# EAGLE design MacroPad (EAGLE 9.4.0)
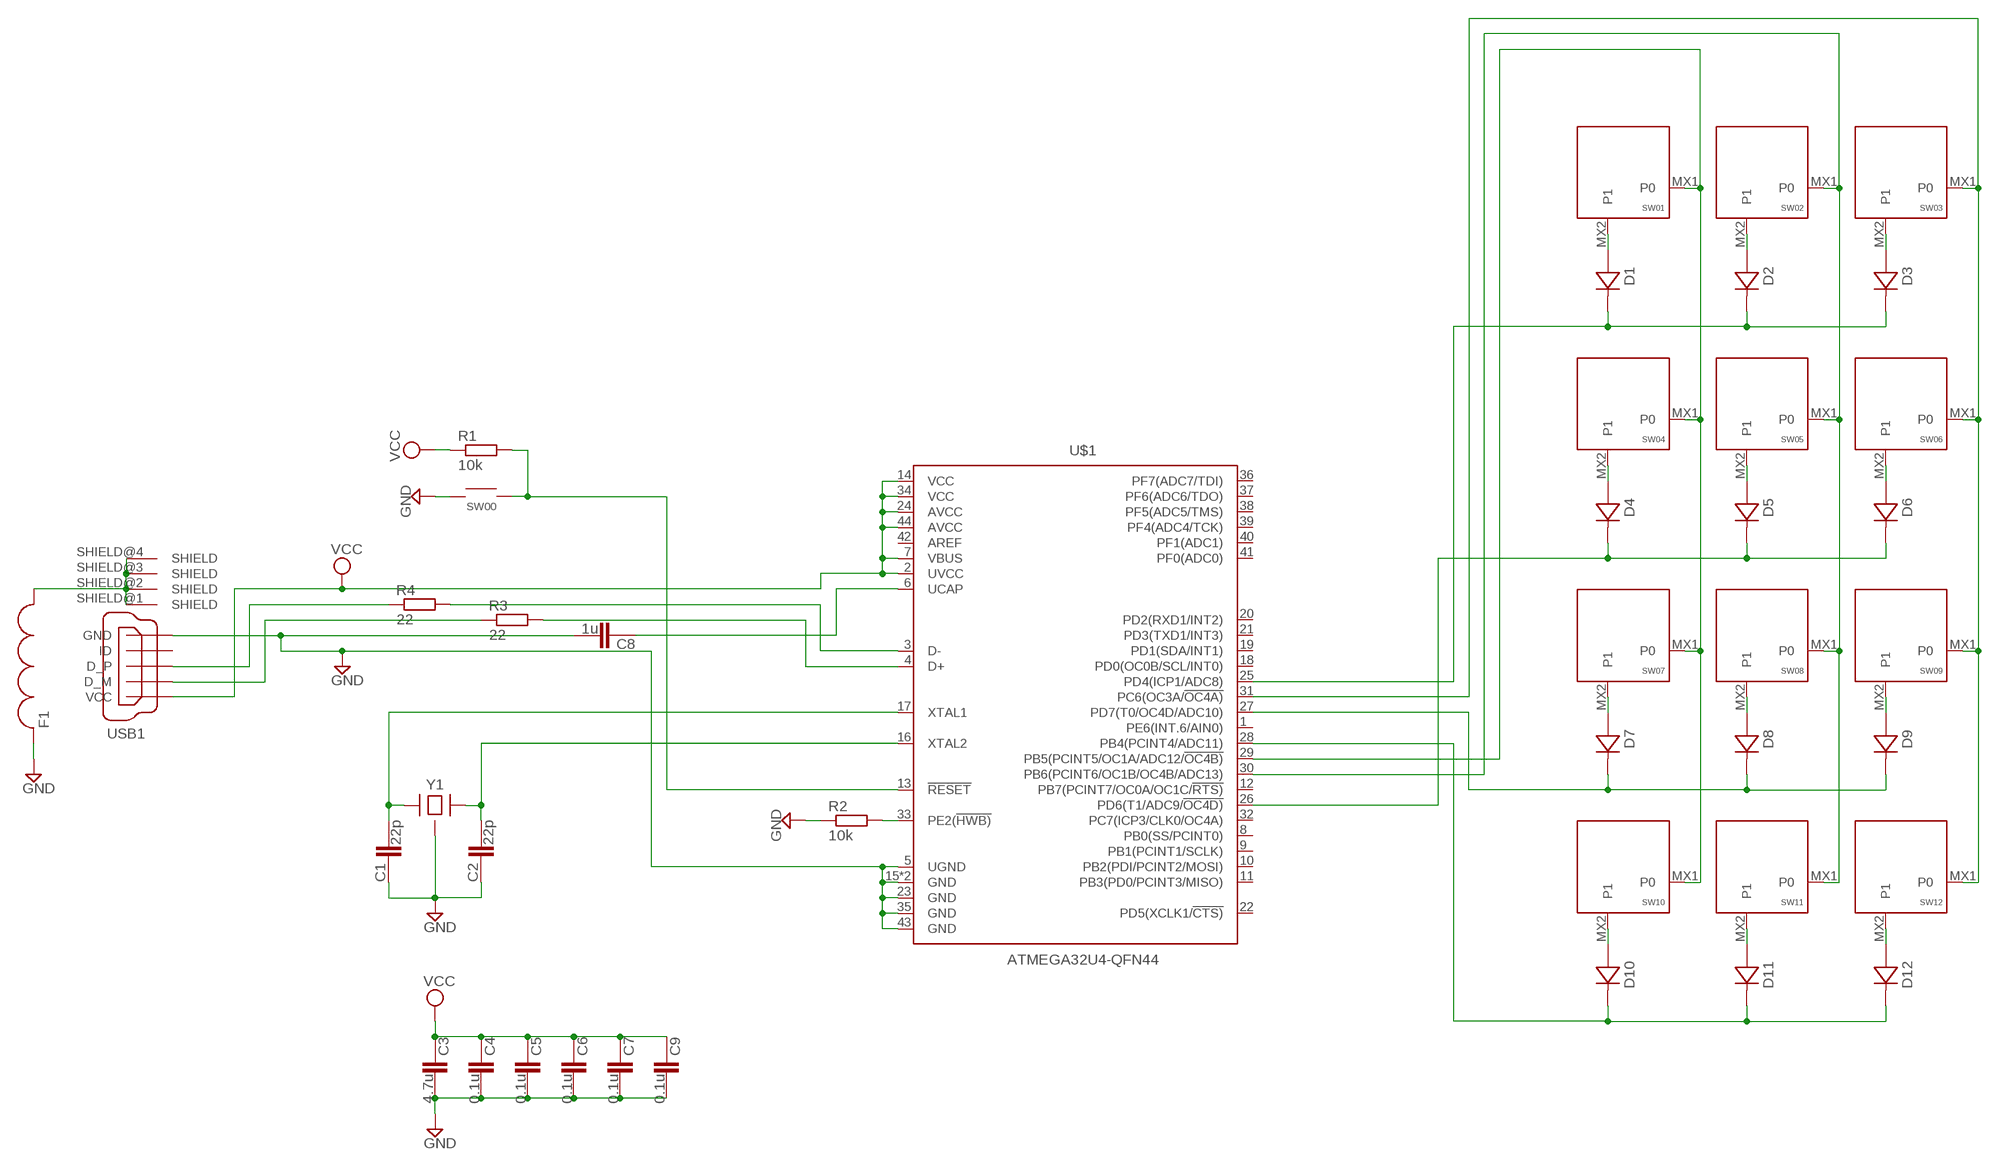
[diagram p0: schematic, sheet 1]

## Parts
C1  22p  CAPACITOR-0603  [C0603]
C2  22p  CAPACITOR-0603  [C0603]
C3  4.7u  CAPACITOR-0603  [C0603]
C4  0.1u  CAPACITOR-0603  [C0603]
C5  0.1u  CAPACITOR-0603  [C0603]
C6  0.1u  CAPACITOR-0603  [C0603]
C7  0.1u  CAPACITOR-0603  [C0603]
C8  1u  CAPACITOR-0603  [C0603]
C9  0.1u  CAPACITOR-0603  [C0603]
D1  DIODE-DFN0603-2  [DFN0603-2]
D2  DIODE-DFN0603-2  [DFN0603-2]
D3  DIODE-DFN0603-2  [DFN0603-2]
D4  DIODE-DFN0603-2  [DFN0603-2]
D5  DIODE-DFN0603-2  [DFN0603-2]
D6  DIODE-DFN0603-2  [DFN0603-2]
D7  DIODE-DFN0603-2  [DFN0603-2]
D8  DIODE-DFN0603-2  [DFN0603-2]
D9  DIODE-DFN0603-2  [DFN0603-2]
D10  DIODE-DFN0603-2  [DFN0603-2]
D11  DIODE-DFN0603-2  [DFN0603-2]
D12  DIODE-DFN0603-2  [DFN0603-2]
F1  FERRITE-0805  [F0805]
R1  10k  RESISTOR-0603  [R0603]
R2  10k  RESISTOR-0603  [R0603]
R3  22  RESISTOR-0603  [R0603]
R4  22  RESISTOR-0603  [R0603]
SW00  SWITCH-SMD-EVQP-P2602W  [SWITCH-SMD-EVQP-P2602W]
SW01  KEYSWITCH-PLAIN-MX-1U  [MX-1U]
SW02  KEYSWITCH-PLAIN-MX-1U  [MX-1U]
SW03  KEYSWITCH-PLAIN-MX-1U  [MX-1U]
SW04  KEYSWITCH-PLAIN-MX-1U  [MX-1U]
SW05  KEYSWITCH-PLAIN-MX-1U  [MX-1U]
SW06  KEYSWITCH-PLAIN-MX-1U  [MX-1U]
SW07  KEYSWITCH-PLAIN-MX-1U  [MX-1U]
SW08  KEYSWITCH-PLAIN-MX-1U  [MX-1U]
SW09  KEYSWITCH-PLAIN-MX-1U  [MX-1U]
SW10  KEYSWITCH-PLAIN-MX-1U  [MX-1U]
SW11  KEYSWITCH-PLAIN-MX-1U  [MX-1U]
SW12  KEYSWITCH-PLAIN-MX-1U  [MX-1U]
U$1  ATMEGA32U4-QFN44  [QFN-44]
USB1  USB_CONN-MINI-FEMALE  [UX60-MB-5S8]
Y1  CRYSTAL-4PIN-3.2X2.5  [CRYSTAL-3.2X2.5]

## Nets
GND: C1.1 C2.1 C3.2 C4.2 C5.2 C6.2 C7.2 C8.2 C9.2 F1.1 R2.1 SW00.1A SW00.1B U$1.5(UGND) U$1.15(GND) U$1.23(GND) U$1.35(GND) U$1.43(GND) U$1.TAB(GND) USB1.GND Y1.2(GND) Y1.4(GND)
N$1: C2.2 U$1.16(XTAL2) Y1.3
N$2: C1.2 U$1.17(XTAL1) Y1.1
N$3: R1.2 SW00.2A SW00.2B U$1.13(!RESET)
N$4: R2.2 U$1.33(PE2(!HWB))
N$5: R4.1 USB1.D+(D_P)
N$6: R4.2 U$1.3(D-)
N$7: R3.1 USB1.D-(D_M)
N$8: R3.2 U$1.4(D+)
N$9: D1.A SW01.MX2(P1)
N$10: SW01.MX1(P0) SW04.MX1(P0) SW07.MX1(P0) SW10.MX1(P0) U$1.29(PB5(PCINT5/OC1A/ADC12/!OC4B))
N$11: F1.2 USB1.SHIELD@1(SHIELD) USB1.SHIELD@2(SHIELD) USB1.SHIELD@3(SHIELD) USB1.SHIELD@4(SHIELD)
N$12: D2.A SW02.MX2(P1)
N$14: D1.C D2.C D3.C U$1.25(PD4(ICP1/ADC8))
N$15: D3.A SW03.MX2(P1)
N$16: SW03.MX1(P0) SW06.MX1(P0) SW09.MX1(P0) SW12.MX1(P0) U$1.31(PC6(OC3A/!OC4A))
N$18: D4.A SW04.MX2(P1)
N$21: D5.A SW05.MX2(P1)
N$24: D6.A SW06.MX2(P1)
N$26: D4.C D5.C D6.C U$1.26(PD6(T1/ADC9/!OC4D))
N$27: D7.A SW07.MX2(P1)
N$30: D8.A SW08.MX2(P1)
N$32: D7.C D8.C D9.C U$1.27(PD7(T0/OC4D/ADC10))
N$33: D9.A SW09.MX2(P1)
N$36: D10.A SW10.MX2(P1)
N$38: D10.C D11.C D12.C U$1.28(PB4(PCINT4/ADC11))
N$39: D11.A SW11.MX2(P1)
N$40: SW02.MX1(P0) SW05.MX1(P0) SW08.MX1(P0) SW11.MX1(P0) U$1.30(PB6(PCINT6/OC1B/OC4B/ADC13))
N$42: D12.A SW12.MX2(P1)
UCAP: C8.1 U$1.6(UCAP)
VCC: C3.1 C4.1 C5.1 C6.1 C7.1 C9.1 R1.1 U$1.2(UVCC) U$1.7(VBUS) U$1.14(VCC) U$1.24(AVCC) U$1.34(VCC) U$1.44(AVCC) USB1.VCC
Unconnected: U$1.1(PE6(INT.6/AIN0)) U$1.8(PB0(SS/PCINT0)) U$1.9(PB1(PCINT1/SCLK)) U$1.10(PB2(PDI/PCINT2/MOSI)) U$1.11(PB3(PD0/PCINT3/MISO)) U$1.12(PB7(PCINT7/OC0A/OC1C/!RTS)) U$1.18(PD0(OC0B/SCL/INT0)) U$1.19(PD1(SDA/INT1)) U$1.20(PD2(RXD1/INT2)) U$1.21(PD3(TXD1/INT3)) U$1.22(PD5(XCLK1/!CTS)) U$1.32(PC7(ICP3/CLK0/OC4A)) U$1.36(PF7(ADC7/TDI)) U$1.37(PF6(ADC6/TDO)) U$1.38(PF5(ADC5/TMS)) U$1.39(PF4(ADC4/TCK)) U$1.40(PF1(ADC1)) U$1.41(PF0(ADC0)) U$1.42(AREF) USB1.ID

## Library data of the parts
C1-C9 = Components:CAPACITOR
D1-D12 = Components:DIODE: Standard 1N4148 diode
F1 = USB:FERRITE
R1-R4 = Components:RESISTOR
SW00 = Hardware:SWITCH-SMD
SW01-SW09 SW10-SW12 = Keyboard:KEYSWITCH-PLAIN
U$1 = Controller:ATMEGA32U4
USB1 = Controller:USB_CONN
Y1 = Components:CRYSTAL-4PIN

## Board
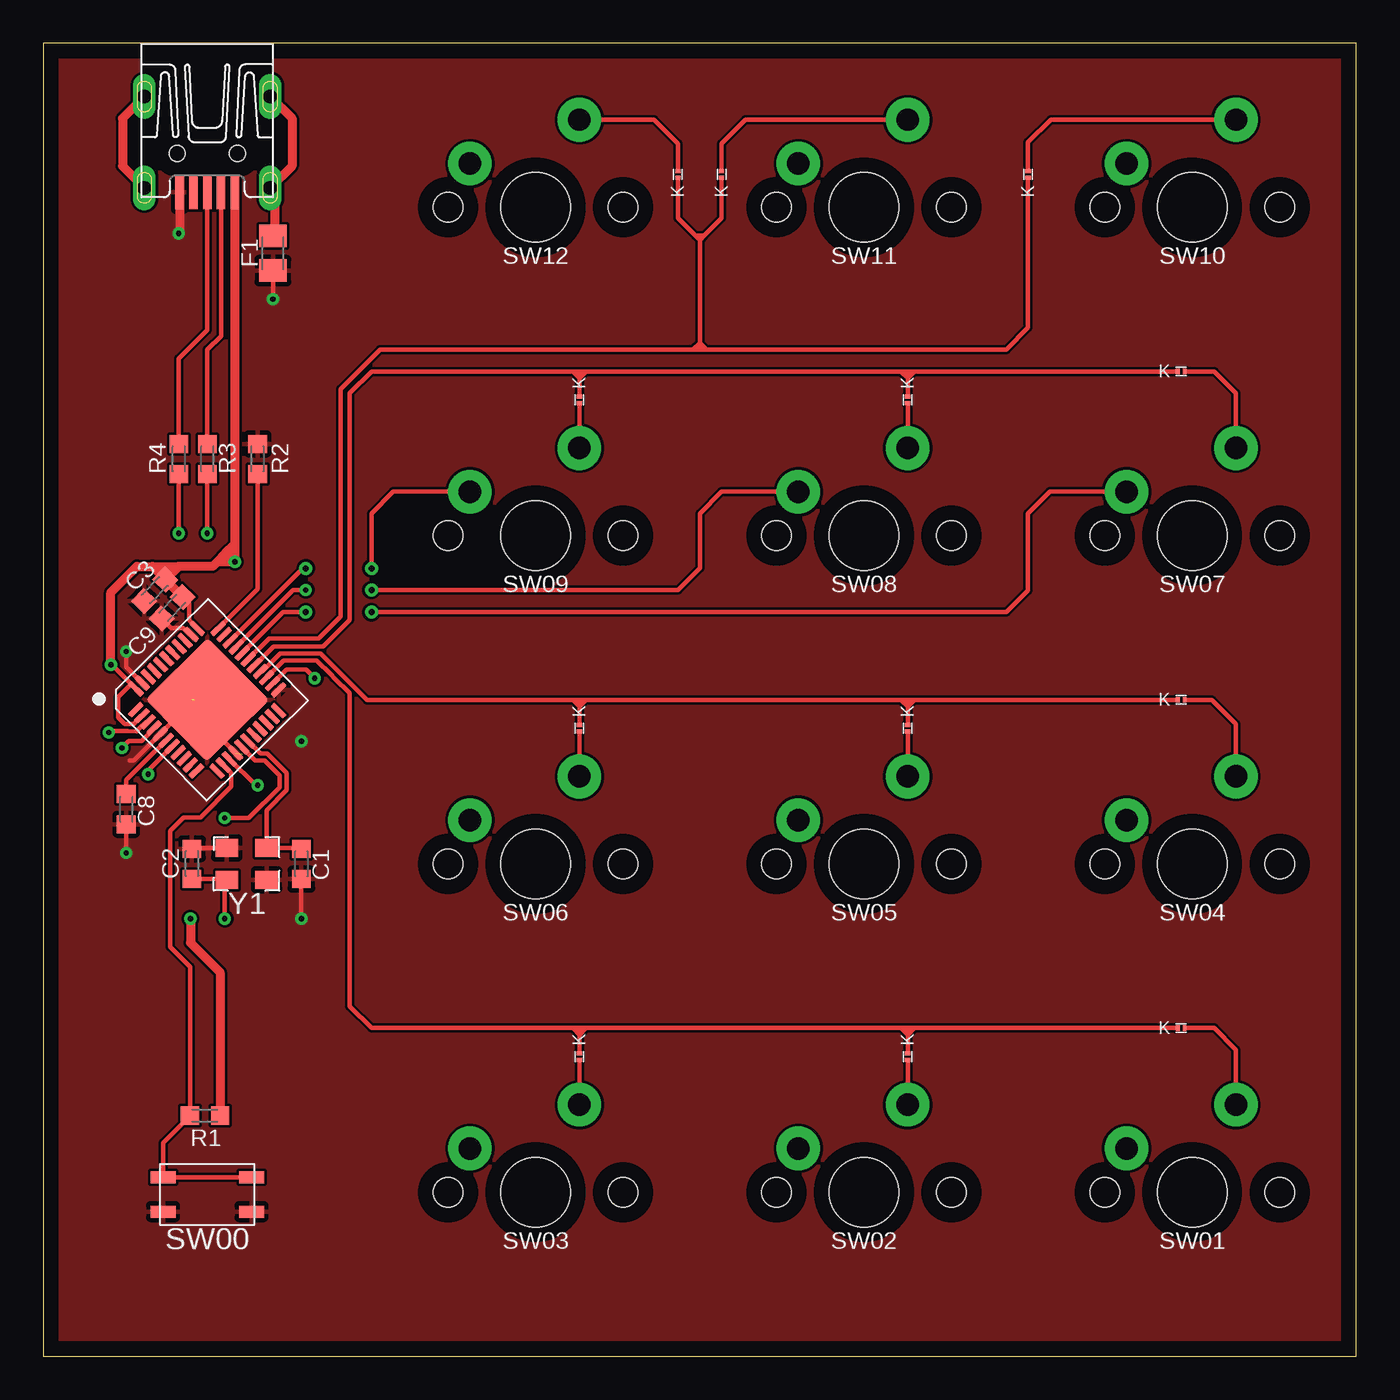
[diagram p1: board, top side]
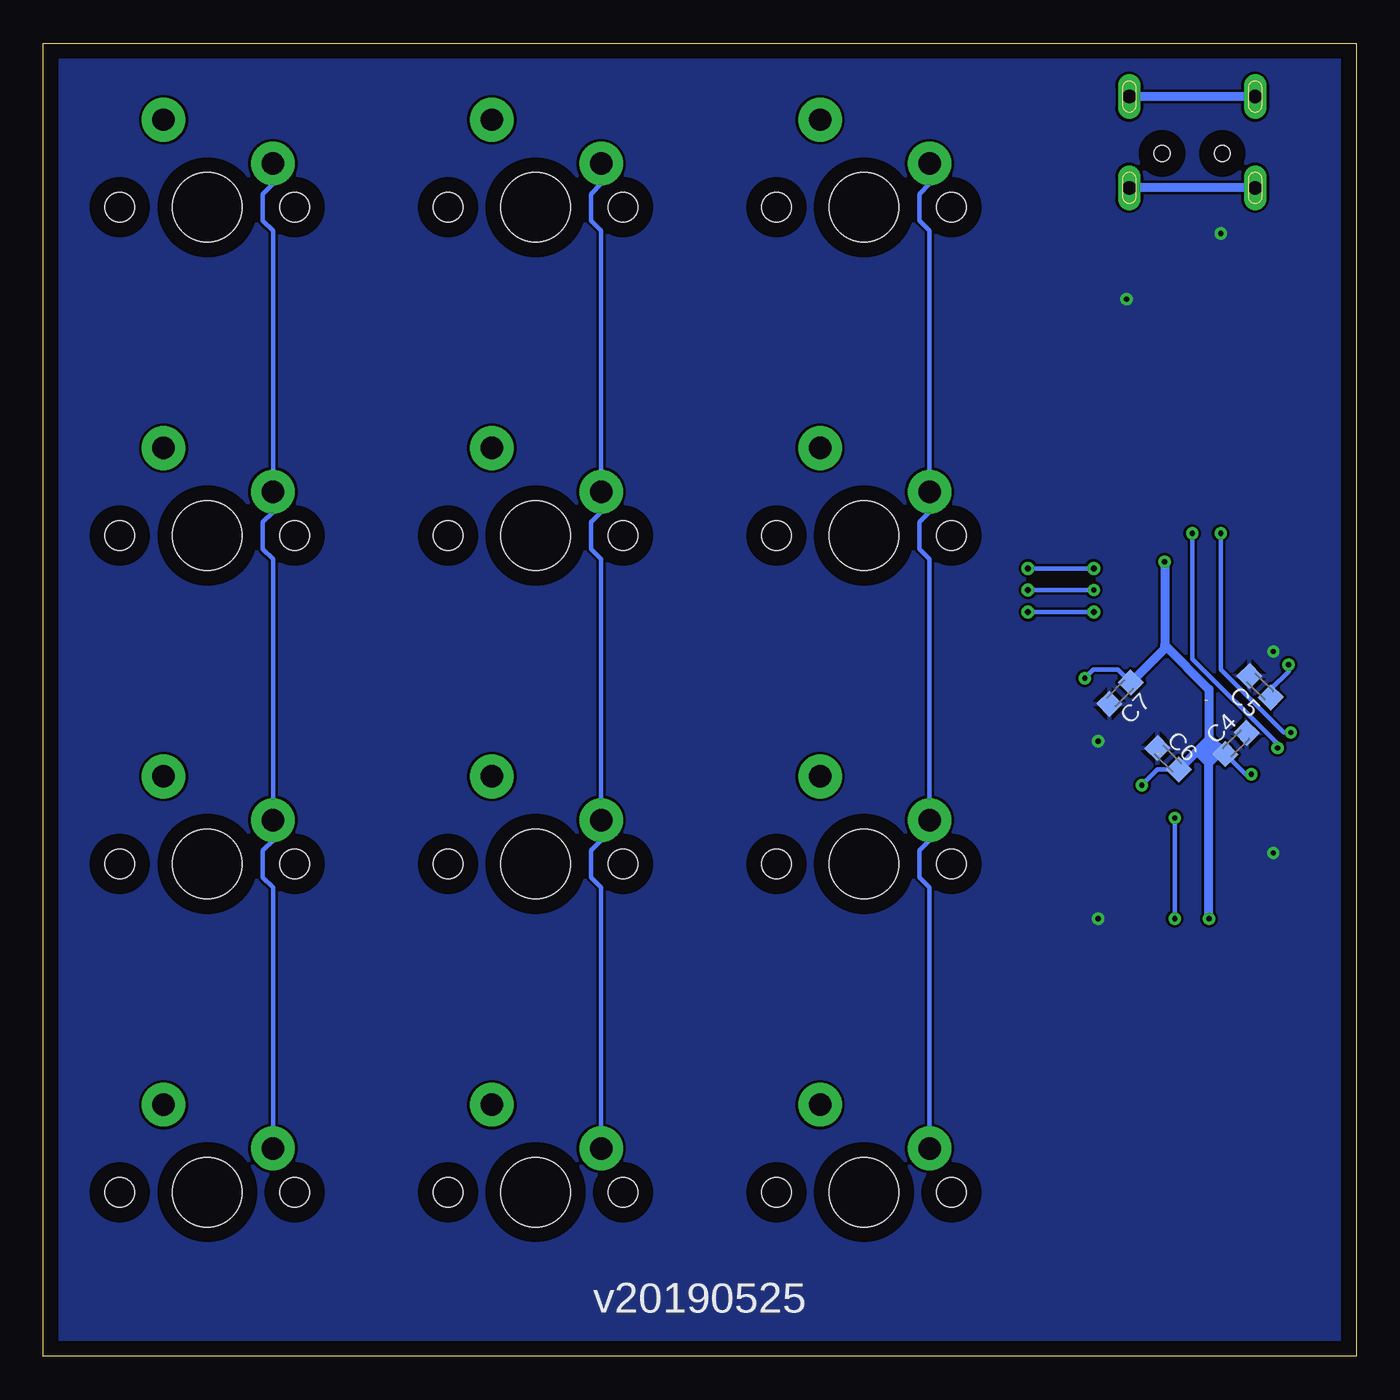
[diagram p2: board, bottom side, seen from below]

Size 76.2 x 76.2 mm. Coordinates in mm from the lower left corner, seen from the top.
Outline: 0,0 76.2,0 76.2,76.2 0,76.19 0,0
Copper layers (1*16): Top 0.035mm / dielectric 1.5mm / Bottom 0.035mm
Design rules "default *": minimum track width 6mil, minimum drill 0.35mm, track to track 6mil, track to pad 6mil, pad to pad 6mil, via to via 6mil, smd to smd 6mil, copper to edge 35mil, drill to drill 6mil, minimum pad ring 10mil, minimum via ring 8mil, stop-mask expansion 4mil, vias tented up to drill 0mil, thermal gap 10mil

### Footprints (pad centres in the part's own frame; a part is rotated, then mirrored left to right if it is on the bottom)
C0603 = smd 1.05 x 1.08: 1 -0.875,0; 2 0.875,0
DFN0603-2 = smd 0.23 x 0.3: A 0.19,0; C -0.19,0
F0805 = smd 1.3 x 1.6: 1 -1,0; 2 1,0
R0603 = smd 1.05 x 1.08: 1 -0.875,0; 2 0.875,0
SWITCH-SMD-EVQP-P2602W = smd 1.45 x 0.7: 1A -2.57,-1; 1B 2.57,-1; 2A -2.57,1; 2B 2.57,1
MX-1U = drill 1.3 pad 2.54: MX1 -3.81,2.54; MX2 2.54,5.08 | hole 4: 0,0 | hole 1.7: -5.08,0; 5.08,0
QFN-44 = smd 1 x 0.3: 1 -3.35,2.5; 2 -3.35,2; 3 -3.35,1.5; 4 -3.35,1; 5 -3.35,0.5; 6 -3.35,0; 7 -3.35,-0.5; 8 -3.35,-1; 9 -3.35,-1.5; 10 -3.35,-2; 11 -3.35,-2.5; 23 3.35,-2.5; 24 3.35,-2; 25 3.35,-1.5; 26 3.35,-1; 27 3.35,-0.5; 28 3.35,0; 29 3.35,0.5; 30 3.35,1; 31 3.35,1.5; 32 3.35,2; 33 3.35,2.5 | smd 0.3 x 1: 12 -2.5,-3.35; 13 -2,-3.35; 14 -1.5,-3.35; 15 -1,-3.35; 16 -0.5,-3.35; 17 0,-3.35; 18 0.5,-3.35; 19 1,-3.35; 20 1.5,-3.35; 21 2,-3.35; 22 2.5,-3.35; 34 2.5,3.35; 35 2,3.35; 36 1.5,3.35; 37 1,3.35; 38 0.5,3.35; 39 0,3.35; 40 -0.5,3.35; 41 -1,3.35; 42 -1.5,3.35; 43 -2,3.35; 44 -2.5,3.35 | smd 5.08 x 5.08: TAB 0,0
UX60-MB-5S8 = smd 2 x 0.5: D+ 8.65,0; D- 8.65,0.8; GND 8.65,-1.6; ID 8.65,-0.8; VCC 8.65,1.6 | drill 0.8 long: SHIELD@1 3.1,-3.65; SHIELD@2 3.1,3.65; SHIELD@3 8.4,-3.65; SHIELD@4 8.4,3.65 | hole 0.9: 6.4,-1.75; 6.4,1.75
CRYSTAL-3.2X2.5 = smd 1.3 x 1.05: 1 -1.15,-0.925; 2 1.15,-0.925; 3 1.15,0.925; 4 -1.15,0.925

### Placement (x,y rotation side)
C1  14.99,28.57 90 top
C2  8.64,28.57 270 top
C3  6.48,44.45 225 top
C4  6.99,35.56 45 bottom
C5  5.59,38.86 135 bottom
C6  10.92,34.67 135 bottom
C7  13.72,38.48 225 bottom
C8  4.83,31.75 270 top
C9  7.49,43.43 226 top
D1  66.04,19.05 0 top
D2  50.16,17.4 270 top
D3  31.11,17.4 270 top
D4  66.04,38.1 0 top
D5  50.16,36.45 270 top
D6  31.11,36.45 270 top
D7  66.04,57.15 0 top
D8  50.16,55.5 270 top
D9  31.11,55.5 270 top
D10  57.15,68.58 90 top
D11  39.37,68.58 90 top
D12  36.83,68.58 90 top
F1  13.34,64.01 90 top
R1  9.4,13.97 180 top
R2  12.45,52.07 270 top
R3  9.53,52.07 270 top
R4  7.87,52.07 270 top
SW00  9.53,9.4 0 top
SW01  66.67,9.53 0 top
SW02  47.62,9.53 0 top
SW03  28.57,9.53 0 top
SW04  66.67,28.57 0 top
SW05  47.62,28.57 0 top
SW06  28.57,28.57 0 top
SW07  66.67,47.62 0 top
SW08  47.62,47.62 0 top
SW09  28.57,47.62 0 top
SW10  66.67,66.67 0 top
SW11  47.62,66.67 0 top
SW12  28.57,66.67 0 top
U$1  9.53,38.1 44.6 top
USB1  9.53,76.2 270 top
Y1  11.81,28.57 180 top

### Tracks (layer width: path | path; a pad name or v marks a point on that pad's centre or on a via)
GND  (via drill 0.3)  (2 unrouted)
  Top 0.254: 5.72,39.08 U$1.43 4.83,40 v4.83,40.89 | 8.6,41.92 U$1.35 8.5,41.89 8.13,42.27 7.42,42.27 C9.2 | C3.2 5.86,43.39 | C2.1 8.69,29.5 Y1.2 11.11,29.5 | Y1.4 13.01,27.7 | F1.1 v13.34,61.34 | C1.1 v14.99,25.4 | C8.2 v4.83,29.21 | U$1.5 6.82,36.1 6.85,36.07 6.86,36.07 | 8.64,37.95 8.64,38.1 | U$1.5 5.27,34.59 5.04,34.59 | 10.16,37.41 10.24,37.34 | 10.87,35.31 U$1.15 10.16,36.02 | U$1.5 8.79,38.1 U$1.TAB
  Top 0.508: USB1.GND 7.92,65.2 v7.87,65.15
  Bottom 0.254: C6.2 11.54,34.94 | 4.83,40.73 v4.83,40.89
  other vias: 14.99,35.69
  pour Top: -1.27,77.47 -1.27,-1.27 77.47,-1.27 77.47,77.47
  pour Bottom: -1.27,77.47 77.47,77.47 77.47,-1.27 -1.27,-1.27
N$1  (via drill 0.3)
  Top 0.254: U$1.16 12.32,34.57 12.85,34.57 13.72,33.7 13.72,33.02 11.94,31.24 v10.54,31.24 | v10.54,25.4 10.54,27.53 Y1.3 10.61,27.7 C2.2
  Bottom 0.254: v10.54,31.24 v10.54,25.4
N$2
  Top 0.254: C1.2 14.94,29.5 Y1.1 12.96,31.69 14.12,32.85 14.12,33.86 13.01,34.97 12.62,34.97 U$1.17
N$3
  Top 0.254: U$1.13 10.92,33.84 10.92,33.06 9.13,31.27 8.16,31.27 7.37,30.48 7.37,23.76 8.52,22.61 8.52,19.05 R1.2 6.96,12.4 SW00.2A SW00.2B
N$4
  Top 0.254: U$1.33 12.45,44.52 R2.2
N$5
  Top 0.254: USB1.D+ 9.53,59.55 7.87,57.9 R4.1
N$6  (via drill 0.3)
  Top 0.254: R4.2 v7.87,47.75 | U$1.3 5.99,36.82 5.61,36.45 5.43,36.27 4.91,36.27 3.73,36.27 v3.81,36.2
  Bottom 0.254: v7.87,47.75 7.87,39.86 4.83,36.82 4.21,36.2 v3.81,36.2
N$7
  Top 0.254: USB1.D- 10.32,59.21 9.53,58.41 R3.1
N$8  (via drill 0.3)
  Top 0.254: R3.2 v9.53,47.75 | v4.57,35.31 4.98,35.71 5.72,35.71 6.44,36.43 U$1.4
  Bottom 0.254: v9.53,47.75 9.53,40.48 4.57,35.52 v4.57,35.31
N$9
  Top 0.254: D1.A 67.94,19.05 69.22,17.78 SW01.MX2
N$10  (via drill 0.35)
  Top 0.254: U$1.29 13.93,43.18 v15.24,43.18 | v19.05,43.18 55.88,43.18 57.15,44.45 57.15,48.9 58.42,50.16 SW07.MX1
  Bottom 0.254: SW10.MX1 62.87,68.04 63.46,67.45 63.46,65.9 62.87,65.31 SW07.MX1 62.87,48.99 63.46,48.4 63.46,46.85 62.87,46.26 SW04.MX1 62.87,29.94 63.46,29.35 63.46,27.8 62.87,27.21 SW01.MX1 | v15.24,43.18 v19.05,43.18
N$11
  Top 0.508: USB1.SHIELD@3 4.61,69.07 4.61,71.83 USB1.SHIELD@1 | USB1.SHIELD@2 14.45,71.83 14.45,69.07 USB1.SHIELD@4 13.43,67.55 13.43,65.1 F1.2
  Bottom 0.508: USB1.SHIELD@3 USB1.SHIELD@4 | USB1.SHIELD@1 USB1.SHIELD@2
N$12
  Top 0.254: D2.A SW02.MX2
N$14
  Top 0.254: U$1.25 13.96,40.39 15.88,40.39 16.7,39.56 16.93,39.33 17.78,38.48 17.78,20.32 19.05,19.05 30.73,19.05 | 50.16,19.05 49.78,19.05 | 49.78,19.05 31.5,19.05 | 31.5,19.05 31.11,19.05 | 31.11,19.05 30.73,19.05 | D3.C 31.11,18.67 | 31.11,18.67 31.11,19.05 | D2.C 50.16,18.67 | 50.16,18.67 50.16,19.05 | D1.C 50.55,19.05 | 50.55,19.05 50.16,19.05 | 30.73,19.05 31.11,18.67 | 31.5,19.05 31.11,18.67 | 49.78,19.05 50.16,18.67 | 50.55,19.05 50.16,18.67
N$15
  Top 0.254: D3.A SW03.MX2
N$16  (via drill 0.35)
  Top 0.254: U$1.31 15.06,45.72 v15.24,45.72 | v19.05,45.72 19.05,48.9 20.32,50.16 SW09.MX1
  Bottom 0.254: SW12.MX1 24.77,68.04 25.36,67.45 25.36,65.9 24.77,65.31 SW09.MX1 24.77,48.99 25.36,48.4 25.36,46.85 24.77,46.26 SW06.MX1 24.77,29.94 25.36,29.35 25.36,27.8 24.77,27.21 SW03.MX1 | v15.24,45.72 v19.05,45.72
N$18
  Top 0.254: D4.A 67.82,38.1 69.22,36.7 SW04.MX2
N$21
  Top 0.254: D5.A SW05.MX2
N$24
  Top 0.254: D6.A SW06.MX2
N$26
  Top 0.254: U$1.26 12.71,39.74 13.77,40.79 16.1,40.79 18.8,38.1 30.73,38.1 | 50.16,38.1 49.78,38.1 | 49.78,38.1 31.5,38.1 | 31.5,38.1 31.11,38.1 | 31.11,38.1 30.73,38.1 | D6.C 31.11,37.72 | 31.11,37.72 31.11,38.1 | D5.C 50.16,37.72 | 50.16,37.72 50.16,38.1 | D4.C 50.55,38.1 | 50.55,38.1 50.16,38.1 | 49.78,38.1 50.16,37.72 | 50.55,38.1 50.16,37.72 | 30.73,38.1 31.11,37.72 | 31.5,38.1 31.11,37.72
N$27
  Top 0.254: SW07.MX2 69.22,55.88 67.94,57.15 D7.A
N$30
  Top 0.254: D8.A SW08.MX2
N$32
  Top 0.254: U$1.27 13.36,41.2 16.26,41.2 17.78,42.72 17.78,55.88 19.05,57.15 30.73,57.15 | 50.16,57.15 49.78,57.15 | 49.78,57.15 31.5,57.15 | 31.5,57.15 31.11,57.15 | 31.11,57.15 30.73,57.15 | D9.C 31.11,56.77 | 31.11,56.77 31.11,57.15 | D8.C 50.16,56.77 | 50.16,56.77 50.16,57.15 | D7.C 50.55,57.15 | 50.55,57.15 50.16,57.15 | 30.73,57.15 31.11,56.77 | 31.5,57.15 31.11,56.77 | 49.78,57.15 50.16,56.77 | 50.55,57.15 50.16,56.77
N$33
  Top 0.254: D9.A SW09.MX2
N$36
  Top 0.254: SW10.MX2 58.47,71.75 57.15,70.44 D10.A
N$38
  Top 0.254: U$1.28 13.11,41.66 16,41.66 17.27,42.93 17.27,56.13 19.56,58.42 37.72,58.42 | D12.C 36.83,66.04 37.85,65.02 | D11.C 39.37,66.04 38.35,65.02 | 38.1,64.77 37.85,65.02 | 38.1,64.77 38.35,65.02 | 37.85,65.02 38.35,65.02 | 38.1,64.77 38.1,58.8 | 38.1,58.8 38.1,58.42 | 38.48,58.42 55.88,58.42 57.15,59.69 D10.C | 38.48,58.42 38.1,58.42 | 37.72,58.42 38.1,58.42 | 38.48,58.42 38.1,58.8 | 37.72,58.42 38.1,58.8
N$39
  Top 0.254: D11.A 39.37,70.36 40.77,71.75 SW11.MX2
N$40  (via drill 0.3, 0.35)
  Top 0.254: U$1.30 14.51,44.47 v15.24,44.47 | v19.05,44.47 36.83,44.47 38.1,45.74 38.1,48.9 39.37,50.16 SW08.MX1
  Bottom 0.254: SW11.MX1 43.81,68.04 44.41,67.45 44.41,65.9 43.81,65.31 SW08.MX1 43.81,48.99 44.41,48.4 44.41,46.85 43.81,46.26 SW05.MX1 43.81,29.94 44.41,29.35 44.41,27.8 43.81,27.21 SW02.MX1 | v15.24,44.47 v19.05,44.47
N$42
  Top 0.254: D12.A 36.83,70.36 35.43,71.75 SW12.MX2
UCAP
  Top 0.254: U$1.6 5.96,34.57 5.95,34.57 4.83,33.44 C8.1
VCC  (via drill 0.3)
  Top 0.254: U$1.24 14.14,39.85 15.25,39.85 v15.76,39.35 | U$1.14 12.32,33.15 v12.45,33.15 | U$1.7 6.1,34 v6.1,33.78 | v3.94,40.13 3.99,40.13 U$1.44 5.13,38.99 5.08,38.99 4.35,38.26 4.35,37.08 4.74,36.68 5.26,36.68 5.74,37.14 U$1.2 | U$1.34 8.48,42.71 8.48,43.68 C9.1
  Top 0.508: USB1.VCC v11.12,46.1 | 10.58,46.57 11.12,47.12 v11.12,46.1 | 10.58,46.57 10.11,46.1 | 7.86,45.83 9.84,45.83 10.11,46.1 | 7.86,45.83 C3.1 | v3.94,40.13 3.94,44.32 5.45,45.83 6.35,45.83 | 6.35,45.83 7.86,45.83 | C3.1 C9.1 | v8.56,25.4 8.56,24 10.27,22.29 R1.1 | v11.12,46.1 10.11,46.1 | v11.12,46.1 10.65,46.57 10.58,46.57 | C3.1 7.1,45.09 6.35,45.83
  Bottom 0.254: v15.76,39.35 15.25,39.85 13.85,39.85 C7.1 | C4.1 6.27,33.61 v6.1,33.78 | v3.94,40.13 3.94,39.75 4.97,38.72 C5.1 | C6.1 11.54,34.05 v12.45,33.15
  Bottom 0.508: v11.12,46.1 11.12,41.27 | 11.12,41.27 8.56,38.71 8.56,35.89 | 8.56,35.89 C4.1 | C6.1 9.35,35.01 | 9.35,35.01 8.97,35.39 | 8.97,35.39 8.56,35.8 | 8.56,35.89 8.56,35.8 | 8.56,35.8 8.56,34.42 | v8.56,25.4 8.56,34.42 | C7.1 11.12,41.07 11.12,41.27 | C4.1 8.05,35.39 8.97,35.39 | C4.1 7.67,35.01 9.14,35.01 | C4.1 8.03,34.94 8.56,34.42 | 8.56,34.42 9.14,35.01 | 9.14,35.01 9.35,35.01

### Text on the board
bPlace: v20190525